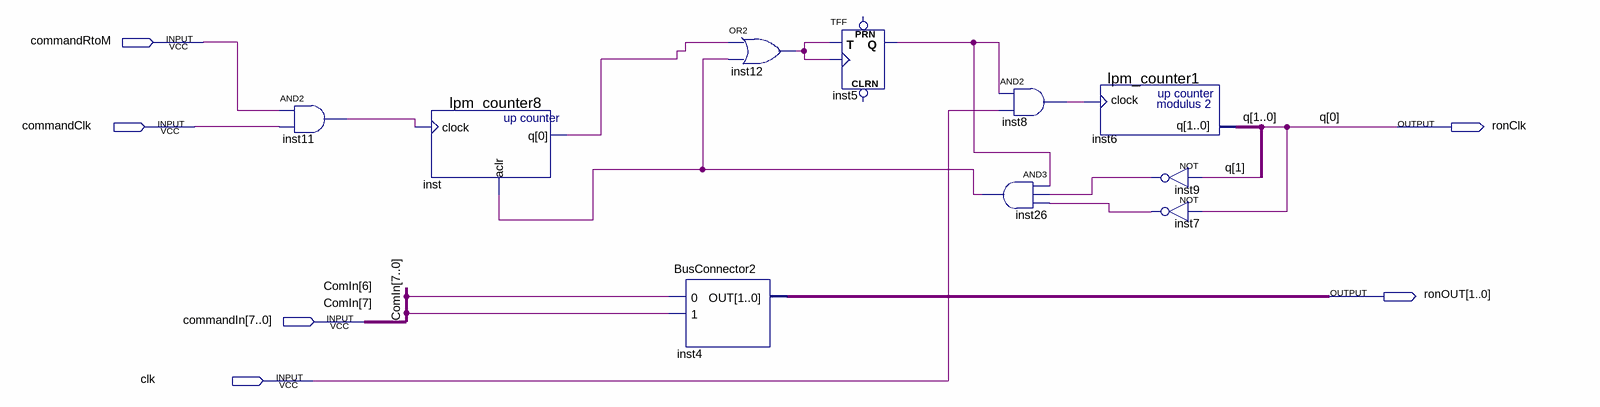
[diagram p0: schematic sheet]
// Quartus schematic RtoM.bdf as structural Verilog: 10 symbols, 6 pins
module RtoM (
  input  commandRtoM,
  input  commandClk,
  input  [7:0] commandIn,
  input  clk,
  output ronClk,
  output [1:0] ronOUT
);

  wire inst5_q, inst7_out, inst8_out, inst9_out, inst11_out, inst12_out, inst26_out, inst_q;
  wire [1:1] q;

  and inst11 (inst11_out, commandRtoM, commandClk);
  lpm_counter8 inst (.clock(inst11_out), .aclr(inst26_out), .q(inst_q));
  BusConnector2 inst4 (.\0 (commandIn[6]), .\1 (commandIn[7]), .OUT(ronOUT));
  or inst12 (inst12_out, inst_q, inst26_out);
  TFF inst5 (.T(inst12_out), .CLK(inst12_out), .Q(inst5_q));  // open: PRN, CLRN
  and inst8 (inst8_out, inst5_q, clk);
  and inst26 (inst26_out, inst5_q, inst9_out, inst7_out);
  lpm_counter1 inst6 (.clock(inst8_out), .q({q[1], ronClk}));
  not inst9 (inst9_out, q[1]);
  not inst7 (inst7_out, ronClk);

  // Other names for the same wires on the sheet: ComIn[7:0] = commandIn; q[0] = ronClk
endmodule
